# EAGLE design PI0E (EAGLE 7.5.0)
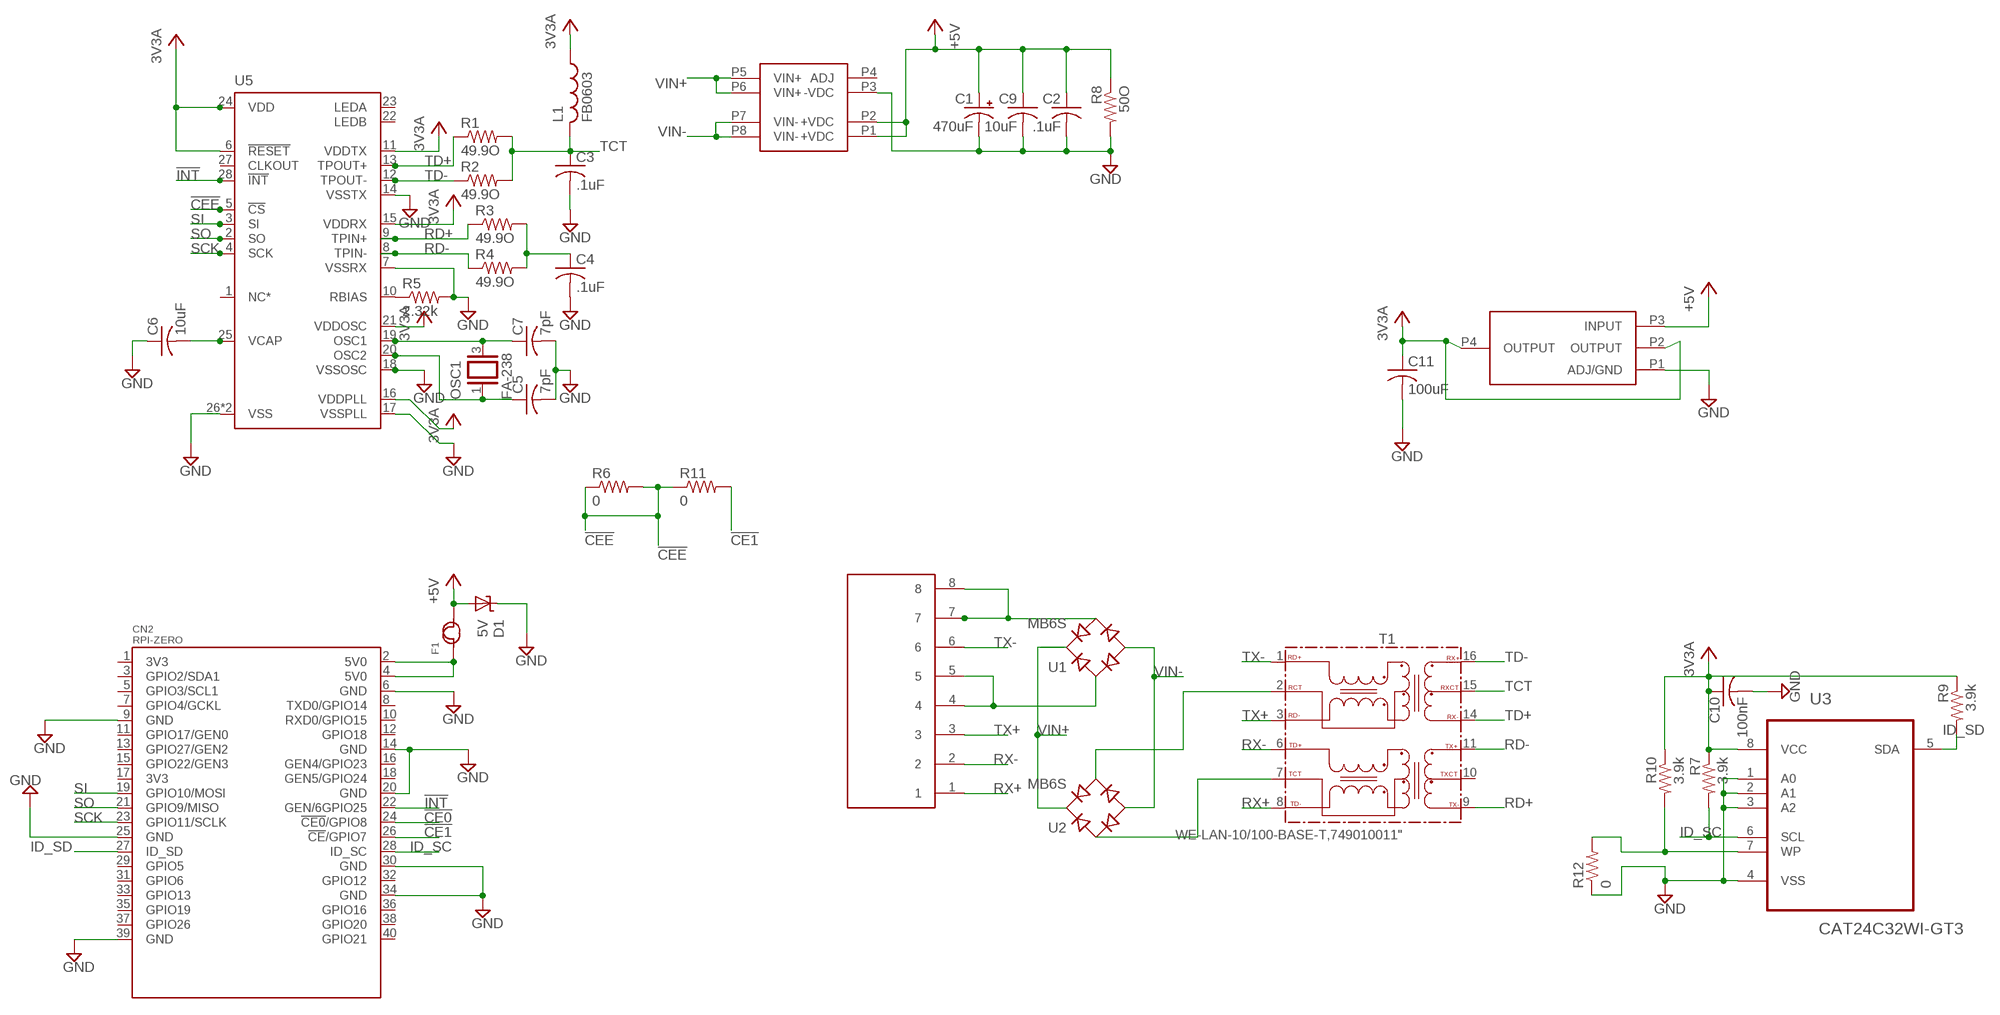
[diagram p0: schematic, sheet 1]

## Parts
C1  470uF  CPOL-USF  [PANASONIC_F]
C2  .1uF  C-USC0603  [C0603]
C3  .1uF  C-USC0603  [C0603]
C4  .1uF  C-USC0603  [C0603]
C5  7pF  C-USC0603  [C0603]
C6  10uF  C-USC0603  [C0603]
C7  7pF  C-USC0603  [C0603]
C9  10uF  C-USC0603  [C0603]
C10  100nF  C-USC0603  [C0603]
C11  100uF  C-USC0805  [C0805]
CN1  RJCSEX38X01XRJCSEX38X01X  [RJCSEX38X01X]
CN2  RPI-ZERO  [RASPBERRYPI_BASTELSTUBE_V13_RASPI_BOARD_B+_FULL]
D1  5V  SUPPRESSOR-SMBJ  [SMBJ]
F1  FUSE'1812'  [F1812]
L1  FB0603  [R0603]
OSC1  FA-238  [FA-238]
R1  49.9O  R-US_R0603  [R0603]
R2  49.9O  R-US_R0603  [R0603]
R3  49.9O  R-US_R0603  [R0603]
R4  49.9O  R-US_R0603  [R0603]
R5  2.32k  R-US_R0603  [R0603]
R6  0  R-US_R0603  [R0603]
R7  3.9k  R-US_R0603  [R0603]
R8  50O  R-US_R0603  [R0603]
R9  3.9k  R-US_R0603  [R0603]
R10  3.9k  R-US_R0603  [R0603]
R11  0  R-US_R0603  [R0603]
R12  0  R-US_R0603  [R0603]
T1  WE-LAN-10/100-BASE-T,749010011"  [749010011]
U1  MB6S  MB4S  [SOIC-4]
U2  MB6S  MB4S  [SOIC-4]
U3  CAT24C32WI-GT3  [SOIC127P600X175-8N]
U4  TLV1117TLV1117DCY  [SOT-223]
U5  ENC28J60QFN28-ML_6X6MM  [QFN28-ML_6X6MM]
U6  AG9800AG9800M  [AG9800M]

## Nets
5V0@1: CN2.2(5V0) CN2.4(5V0) F1.1
!CE0: CN2.24(!CE0!/GPIO8)
!CE1: CN2.26(!CE!/GPIO7) R11.2
!CEE: R6.1 R6.2 R11.1 U5.5(!CS)
!INT: CN2.22(GEN/6GPIO25) U5.28(!INT)
+3V3: C10.1 C11.1 L1.1 R7.1 R9.1 R10.1 U3.8(VCC) U4.P2(OUTPUT) U4.P4(OUTPUT) U5.6(!RESET) U5.11(VDDTX) U5.15(VDDRX) U5.16(VDDPLL) U5.21(VDDOSC) U5.24(VDD) ; supply symbol labelled 3V3A
+5V: C1.+ C2.1 C9.1 D1.A F1.2 R8.1 U4.P3(INPUT) U6.P1(+VDC) U6.P2(+VDC)
GND: C1.- C2.2 C3.2 C4.2 C5.2 C6.1 C7.2 C9.2 C10.2 C11.2 CN2.6(GND) CN2.9(GND) CN2.14(GND) CN2.20(GND) CN2.25(GND) CN2.30(GND) CN2.34(GND) CN2.39(GND) D1.C R5.2 R8.2 R12.1 U3.1(A0) U3.2(A1) U3.3(A2) U3.4(VSS) U4.P1(ADJ/GND) U5.7(VSSRX) U5.14(VSSTX) U5.17(VSSPLL) U5.18(VSSOSC) U5.26(VSS) U5.EXP(VSS) U6.P3(-VDC)
ID_SC: CN2.28(ID_SC) R7.2 U3.6(SCL)
ID_SD: CN2.27(ID_SD) R9.2 U3.5(SDA)
N$1: T1.7(TCT) U2.~1(AC1)
N$4: R10.2 R12.2 U3.7(WP)
N$5: CN1.7 CN1.8 U1.~2(AC2)
N$6: CN1.4 CN1.5 U1.~1(AC1)
N$7: T1.2(RCT) U2.~2(AC2)
N$8: C7.1 OSC1.3 U5.19(OSC1)
N$10: C5.1 OSC1.1 U5.20(OSC2)
N$14: C6.2 U5.25(VCAP)
N$18: C4.1 R3.2 R4.2
N$38: R5.1 U5.10(RBIAS)
RD+: R3.1 T1.9(TX-) U5.9(TPIN+)
RD-: R4.1 T1.11(TX+) U5.8(TPIN-)
RX+: CN1.1 T1.8(TD-)
RX-: CN1.2 T1.6(TD+)
SCK: CN2.23(GPIO11/SCLK) U5.4(SCK)
SI: CN2.19(GPIO10/MOSI) U5.3(SI)
SO: CN2.21(GPIO9/MISO) U5.2(SO)
TCT: C3.1 L1.2 R1.2 R2.2 T1.15(RXCT)
TD+: R1.1 T1.14(RX-) U5.13(TPOUT+)
TD-: R2.1 T1.16(RX+) U5.12(TPOUT-)
TX+: CN1.3 T1.3(RD-)
TX-: CN1.6 T1.1(RD+)
VIN+: U1.+ U2.+ U6.P5(VIN+) U6.P6(VIN+)
VIN-: U1.- U2.- U6.P7(VIN-) U6.P8(VIN-)
Unconnected: CN2.1(3V3) CN2.3(GPIO2/SDA1) CN2.5(GPIO3/SCL1) CN2.7(GPIO4/GCKL) CN2.8(TXD0/GPIO14) CN2.10(RXD0/GPIO15) CN2.11(GPIO17/GEN0) CN2.12(GPIO18) CN2.13(GPIO27/GEN2) CN2.15(GPIO22/GEN3) CN2.16(GEN4/GPIO23) CN2.17(3V3) CN2.18(GEN5/GPIO24) CN2.29(GPIO5) CN2.31(GPIO6) CN2.32(GPIO12) CN2.33(GPIO13) CN2.35(GPIO19) CN2.36(GPIO16) CN2.37(GPIO26) CN2.38(GPIO20) CN2.40(GPIO21) T1.4(NC) T1.5(NC) T1.10(TXCT) T1.12(NC) T1.13(NC) U5.1(NC*) U5.22(LEDB) U5.23(LEDA) U5.27(CLKOUT) U6.P4(ADJ)

## Library data of the parts
C1 = rcl:CPOL-US: POLARIZED CAPACITOR, American symbol
C2-C7 C9-C11 = rcl:C-US: CAPACITOR, American symbol
CN1 = rj45:RJCSEX38X01X
CN2 = RPI-Zero:RPI-ZERO
D1 = diode:SUPPRESSOR-: Suppressor diode
F1 = Seeed-OPL-fuse:FUSE
L1 =  ENC28J60-QFN:FB: Ferrite bead Digikey #P9821BK-ND
OSC1 =  ENC28J60-QFN:FA-238
R1-R5 R7-R10 = rcl:R-US_: RESISTOR, American symbol
R6 R11 R12 = resistor:R-US_: RESISTOR, American symbol
T1 = EagleLibrary_Wuerth_Elektronik_eiSos_rev16a:WE-LAN-10/100-BASE-T,749010011: LAN-Transformer WE-LAN 10/100 Base T - Compliant with IEEE 802.3 standards - SMD -- Ethernet -- Power over Ethernet -- 1 Gigabit Ethernet -- Compliant with most IC's for ethernet applications like Intel, AMD, Globespan and Realtek -- Hub, Router, Switch <http://katalog.we-online.de/media/images/eisos/UtLAN_pf2.jpg> Details see: http://katalog.we-online.de/en/pbs/WE-LAN/S/749010011? Updated by Dan Xu 2014-07-08 2014 (C) Würth Elektronik; COMPANY-URL: http://www.we-online.de; CREATED-BY: Christin Zierenner; CREATED-DATE: June 2012; DATASHEET-URL: http://katalog.we-online.de/kataloge/eisos/media/pdf/749010011.pdf; MANUFACTURER: Würth Elektronik eiSos GmbH
U1 U2 = rectifier:MB*S: Bridge Rectifier Source: http://www.fairchildsemi.com/ds/MB/MB6S.pdf
U3 = Catalyst_Semiconductor_By_element14_Batch_1:CAT24C32WI-GT3: 32-Kb I2C CMOS Serial EEPROM; MPN: CAT24C32WI-GT3; OC_FARNELL: 1718129; OC_NEWARK: 08R5414; PACKAGE: SOIC-8; SUPPLIER: CATALYST SEMICONDUCTOR
U4 = texas_instruments:TLV1117
U5 = microchip:ENC28J60: Stand-Alone Ethernet Controller with SPI Interface Source: http://ww1.microchip.com/downloads/en/DeviceDoc/39662c.pdf
U6 = silvertell:AG9800

## Board
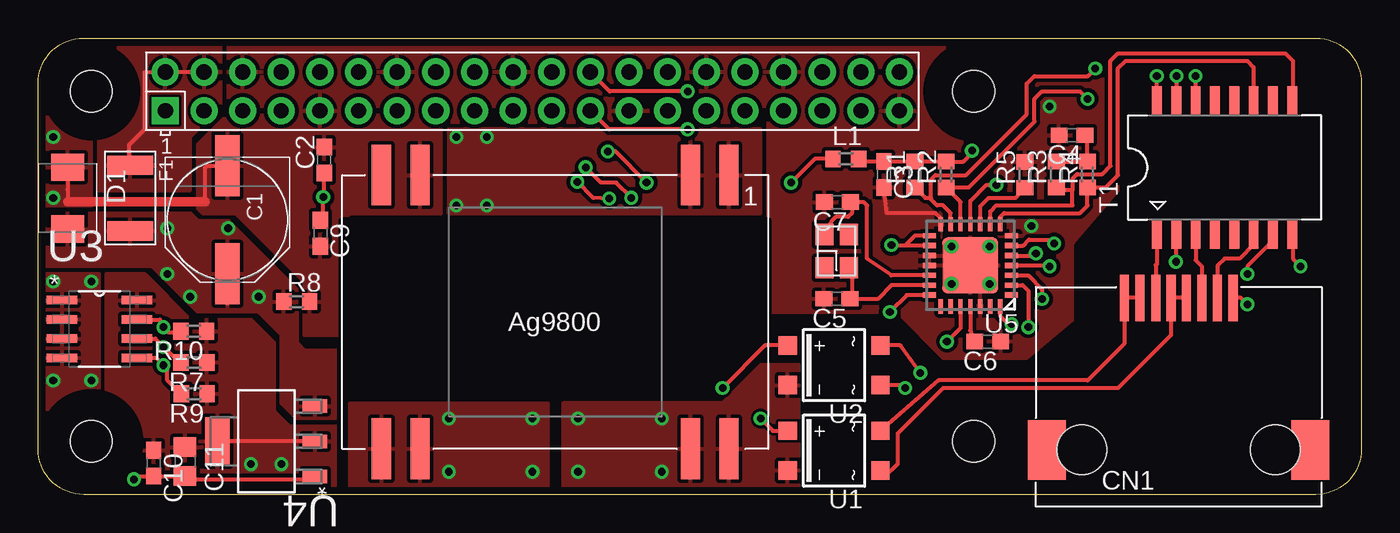
[diagram p1: board, top side]
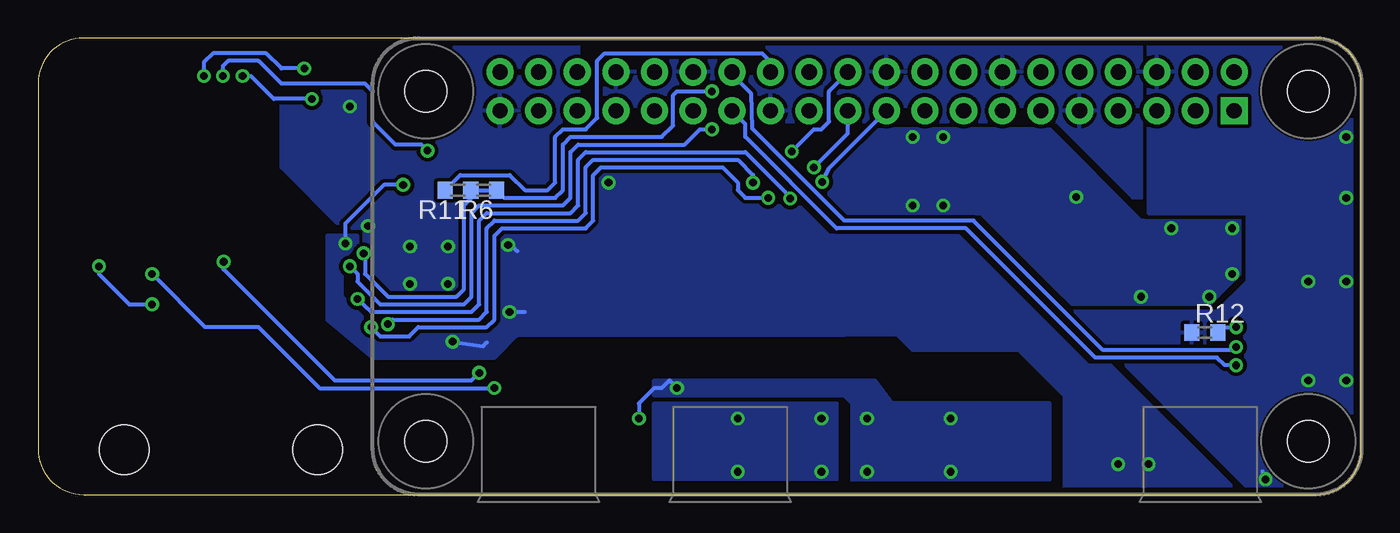
[diagram p2: board, bottom side, seen from below]

Size 87 x 30 mm. Coordinates in mm from the lower left corner, seen from the top.
Outline: 0,3 0,27 arc-90 3,30 84,30 arc-90 87,27 87,3 arc-90 84,0 3,0 arc-90 0,3
Copper layers (1*16): Top 0.035mm / dielectric 1.5mm / Bottom 0.035mm
Design rules "default *": minimum track width 10mil, minimum drill 0.499871875mm, track to track 7mil, track to pad 7mil, pad to pad 7mil, via to via 7mil, smd to smd 7mil, copper to edge 0.5mm, drill to drill 7mil, minimum pad ring 10mil, minimum via ring 8mil, stop-mask expansion 4mil, vias tented up to drill 0mil, thermal gap 10mil
tRestrict: area 0.3,23.3 to 6.7,29.7; area 0.3,0.3 to 6.7,6.7; area 58.3,0.3 to 64.7,6.7; area 58.5,23.5 to 64.5,29.5
bRestrict: area 0.5,23.5 to 6.5,29.5; area 0.5,0.5 to 6.5,6.5; area 58.5,0.5 to 64.5,6.5; area 58.5,23.5 to 64.5,29.5

### Footprints (pad centres in the part's own frame; a part is rotated, then mirrored left to right if it is on the bottom)
PANASONIC_F = smd 4 x 1.6: + 3.55,0; - -3.55,0
C0603 = smd 1.1 x 1: 1 -0.85,0; 2 0.85,0
C0805 = smd 1.3 x 1.5: 1 -0.95,0; 2 0.95,0
RJCSEX38X01X = smd 0.61 x 3.05: 1 3.57,4.99; 2 2.55,4.99; 3 1.53,4.99; 4 0.501,4.99; 5 -0.501,4.99; 6 -1.503,4.99; 7 -2.55,4.99; 8 -3.57,4.99 | smd 2.5 x 3.9: P$4 8.66,-5; P$5 -8.66,-5 | hole 3.25: -6.35,-4.99; 6.35,-4.99
RASPBERRYPI_BASTELSTUBE_V13_RASPI_BOARD_B+_FULL = drill 1 pad 1.778 square: 1 8.37,25.23 | drill 1 pad 1.778: 2 8.37,27.77; 3 10.91,25.23; 4 10.91,27.77; 5 13.45,25.23; 6 13.45,27.77; 7 15.99,25.23; 8 15.99,27.77; 9 18.53,25.23; 10 18.53,27.77; 11 21.07,25.23; 12 21.07,27.77; 13 23.61,25.23; 14 23.61,27.77; 15 26.15,25.23; 16 26.15,27.77; 17 28.69,25.23; 18 28.69,27.77; 19 31.23,25.23; 20 31.23,27.77; 21 33.77,25.23; 22 33.77,27.77; 23 36.31,25.23; 24 36.31,27.77; 25 38.85,25.23; 26 38.85,27.77; 27 41.39,25.23; 28 41.39,27.77; 29 43.93,25.23; 30 43.93,27.77; 31 46.47,25.23; 32 46.47,27.77; 33 49.01,25.23; 34 49.01,27.77; 35 51.55,25.23; 36 51.55,27.77; 37 54.09,25.23; 38 54.09,27.77; 39 56.63,25.23; 40 56.63,27.77 | hole 2.75: 3.5,3.5; 3.5,26.5; 61.5,3.5; 61.5,26.5
SMBJ = smd 1.78 x 2.16: A 2.04,0; C -2.03,0
F1812 = smd 1.27 x 3.048: 1 -2.159,0; 2 2.159,0
R0603 = smd 1 x 1.1: 1 -0.85,0; 2 0.85,0
FA-238 = smd 1.4 x 1.2: 1 -1.1,-0.8; 3 1.1,0.8; GND1 -1.1,0.8; GND2 1.1,-0.8
749010011 = smd 0.64 x 1.91: 1 -4.445,-4.385; 2 -3.175,-4.385; 3 -1.905,-4.385; 4 -0.635,-4.385; 5 0.635,-4.385; 6 1.905,-4.385; 7 3.175,-4.385; 8 4.445,-4.385; 9 4.445,4.385; 10 3.175,4.385; 11 1.905,4.385; 12 0.635,4.385; 13 -0.635,4.385; 14 -1.905,4.385; 15 -3.175,4.385; 16 -4.445,4.385
SOIC-4 = smd 1.2 x 1.2: + 1.3,3.05; - -1.3,3.05; ~1 -1.3,-3.05; ~2 1.3,-3.05
SOIC127P600X175-8N = smd 1.981 x 0.559: 1 -2.464,1.905; 2 -2.464,0.635; 3 -2.464,-0.635; 4 -2.464,-1.905; 5 2.464,-1.905; 6 2.464,-0.635; 7 2.464,0.635; 8 2.464,1.905
SOT-223 = smd 1.626 x 0.889: P1 -3.2,2.311; P2 -3.2,0; P3 -3.2,-2.311 | smd 1.626 x 3.175: P4 3.2,0
QFN28-ML_6X6MM = smd 0.94 x 0.35: 1 -2.7,1.95; 2 -2.7,1.3; 3 -2.7,0.65; 4 -2.7,0; 5 -2.7,-0.65; 6 -2.7,-1.3; 7 -2.7,-1.95; 15 2.7,-1.95; 16 2.7,-1.3; 17 2.7,-0.65; 18 2.7,0; 19 2.7,0.65; 20 2.7,1.3; 21 2.7,1.95 | smd 0.35 x 0.94: 8 -1.95,-2.7; 9 -1.3,-2.7; 10 -0.65,-2.7; 11 0,-2.7; 12 0.65,-2.7; 13 1.3,-2.7; 14 1.95,-2.7; 22 1.95,2.7; 23 1.3,2.7; 24 0.65,2.7; 25 0,2.7; 26 -0.65,2.7; 27 -1.3,2.7; 28 -1.95,2.7 | smd 3.7 x 3.7: EXP 0,0
AG9800M = smd 1.25 x 4: P1 -11.43,-9; P2 -8.89,-9; P3 8.89,-9; P4 11.43,-9; P5 11.43,9; P6 8.89,9; P7 -8.89,9; P8 -11.43,9

### Placement (x,y rotation side)
C1  12.45,18.06 270 top
C2  18.82,21.99 90 top
C3  55.61,21.03 270 top
C4  67.97,23.62 180 top
C5  52.52,12.87 180 top
C6  62.43,10.06 180 top
C7  52.55,19.22 180 top
C9  18.56,17.17 270 top
C10  7.61,2.07 270 top
C11  9.66,2.17 270 top
CN1  74.98,7.93 0 top
CN2  0,0 0 top
D1  1.94,19.49 270 top
F1  6.06,19.48 270 top
L1  53.1,22.06 0 top
OSC1  52.5,16 90 top
R1  57.64,21.03 90 top
R2  59.69,21.03 90 top
R3  66.94,21.03 90 top
R4  68.99,21.03 90 top
R5  64.88,21.01 90 top
R6  57.7,20 180 bottom
R7  10.25,8.68 180 top
R8  17.01,12.68 0 top
R9  10.27,6.62 180 top
R10  10.24,10.73 180 top
R11  59.4,20 180 bottom
R12  10.3,10.65 0 bottom
T1  78,21.5 0 top
U1  52.33,2.89 90 top
U2  52.33,8.5 90 top
U3  4.04,10.88 0 top
U4  15,3.5 180 top
U5  61.29,15.06 180 top
U6  34,12 180 top

### Tracks (layer width: path | path; a pad name or v marks a point on that pad's centre or on a via)
5V0@1
  Top 0.254: F1.1 6.06,21.94 6,22 6,23 7,24 7,27.75 CN2.2 CN2.4
  pour Top: 4,23.5 4,20 10,20 10,23.5 12,25.5 12,29.5 3.5,29.5 3.5,24
!CE0  (via drill 0.5)
  Top 0.254: v42.7,26.5 37.58,26.5 CN2.24
  Bottom 0.254: 56.35,19.5 53,19.5 52.5,20 52.5,23 52,23.5 46,23.5 45.25,24.25 45.25,26.25 45,26.5 v42.7,26.5
!CE1
  Bottom 0.254: CN2.26 38.85,28.45 39.4,29 49.75,29 50.25,28.5 50.25,24.75 51,24 52.5,24 53,23.5 53,20.5 53.5,20 55,20 56,21 59.25,21 R11.2
!CEE  (via drill 0.5)
  Top 0.254: U5.5 65.46,15.71 v65.6,15.85
  Bottom 0.254: v65.6,15.85 65.5,15.75 65.5,14.5 64,13 59.5,13 59,13.5 59,19 58.55,19.45 R11.1 R6.1
!INT  (via drill 0.5)
  Top 0.254: U5.28 63.24,11.76 63.8,11.2 v64,11.2 | v40,20.5 37.95,22.55 v37.45,22.55
  Bottom 0.254: v40,20.5 40,21 41,22 50.5,22 51,21.5 51,18.5 51.5,18 57,18 57.5,17.5 57.5,12 58,11.5 63.7,11.5 v64,11.2 | CN2.22 33.77,27.73 35,26.5 35,24.5 35.5,24 36,24 v37.45,22.55
+3V3  (via drill 0.5)
  Top 0.254: U4.P2 U4.P4 | L1.1 51.06,22.06 v49.5,20.5 | U5.6 64.76,16.36 65.15,16.75 66.75,16.75 v66.8,16.5 | U5.21 57.11,13.11 v56,12 | U5.16 57,16.36 | 57,16.36 56.41,16.36 v56.1,16.4 | U5.15 57.65,17.01 57,16.36 | U5.11 61.29,19.29 62.35,20.35 v63,20.35 | U5.24 60.64,10.94 v59.75,10.05
  Bottom 0.254: v59.75,10.05 57.75,9.75 57.5,10 | v56,12 55,12 | v56.1,16.4 55.85,16.35 55.5,16 | v63,20.35 64.25,20.35 66.8,17.8 v66.8,16.5
  other vias: 14,2 16,2
  pour Top (isolate 0.254, rank 3): 4.5,14.5 7,14.5 10,11.5 14,11.5 15.5,10 15.5,5.5 16.5,4.5 19.5,4.5 19.5,0 4,0 4.5,0.5
  pour Bottom (isolate 0.254): 8.5,0.5 19.5,0.5 19.5,6.5 22.5,9.5 29.5,9.5 30.5,10.5 34,10.5 34,17 26.5,17 18,8.5 16.5,8.5
  pour Bottom (isolate 0.254, rank 2): 34,17 35,17 42,24 51,24 51,10.5 34,10.5
  pour Bottom (isolate 0.254, rank 6): 51,17 56.5,17 57,16.5 57,11.5 58,10.5 58,9 57,9 55.5,10.5 51,10.5
  pour Bottom (isolate 0.254): 57.5,10.5 65,10.5 65,9 57,9 57,10
  pour Bottom (isolate 0.254, rank 6): 64.5,10.5 67,13 67,15.5 66,16.5 66,17 68,17 68,11.5 65,9 64.5,9
+5V  (via drill 0.5)
  Top 0.254: C1.+ 12.45,12.55 | C9.1 18.75,18.21 v18.75,19.55 18.82,19.62 C2.1
  other vias: 27.5,23.5 29.5,23.5 29.5,19 27.5,19 14.5,13 8.5,17.5 8.5,14.5 12.5,17.5 10,13
  pour Top (isolate 0.254, rank 2): 0,18.5 10,18.5 10.5,18 12.5,18 17,13.5 17,10.5 16,10.5 14.5,12 10.5,12 7.5,15 0,15
  pour Top (isolate 0.254): 16,10.5 17,10.5 17,10 17.5,9.5 19.5,9.5 19.5,5 17,5 16,6
  pour Top (isolate 0.254, rank 2): 47.5,18.5 47.5,24 27,24 27,18.5
  pour Bottom (isolate 0.254, rank 2): 39.5,24 34,18.5 25,18.5 19,12.5 10,12.5 8,14.5 8,18 14.5,18 20.5,24
GND  (via drill 0.5)
  Top 0.254: D1.C 1.94,20.06 1.95,19.25 | 11,19.25 11,21.5 11.11,21.61 C1.- | 17.88,0.87 U4.P1 17.5,1 9.83,1 C11.2 C10.2 6.52,1.22 v6.3,1 | U5.14 59.34,18.16 59,18.5 55.79,18.5 C3.2
  Top 0.61: 1.95,19.25 11,19.25
  Bottom 0.254: v6.3,1 6.5,1.5
  other vias: 1,14 3.5,14 3.5,7.5 1,7.5 1,19.5 1,23.5 60.05,16.3 60.05,13.85 62.55,16.3 62.55,13.85 66.5,25.5 65.3,17.65
  pour Top (rank 3): 3.5,23.5 0,25.5 0,19 3.5,19
  pour Top (isolate 0.254, rank 3): 26.5,18.5 26.5,29.5 12.5,29.5 12.5,25 10.5,23 10.5,18.5 13,18.5 17.5,14 17.5,10.5 20,10.5 20,18 20.5,18.5
  pour Top (isolate 0.254): 0,14.5 4,14.5 4,0 0,0
  pour Top (isolate 0.254): 26.5,29.5 26.5,24.5 59,24.5 59,29.5
  pour Bottom (isolate 0.254): 14,18.5 7.5,18.5 7.5,14 9.5,12 19,12 7,0 3,0 0,3 0,26.5 3.5,30 14,30
  pour Bottom (isolate 0.254): 62.5,21 63,21.5 71,21.5 71,30 62.5,30
  pour Top (isolate 0.254): 62.5,30 71,30 71,21.5 62.5,21.5
  pour Bottom (isolate 0.254, rank 2): 56.5,18 57,17.5 57,12 58,11 64.5,11 65.5,12 65.5,17.5 66,18
  pour Bottom (isolate 0.254): 51.5,30 51.5,17.5 67,17.5 71,21.5 71,30
  pour Top (isolate 0.254): 48,30 48,12 56.5,12 59.5,9 65,9 68,11.5 68,16.5 71,20 71,30
  pour Bottom (isolate 0.254): 60.5,18 60.5,17.5 62.5,17.5 62.5,18
  pour Bottom (isolate 0.254, rank 3): 14.5,19.5 15,19.5 20,24.5 23,24.5 51.5,24.5 51.5,30 14.5,30
ID_SC  (via drill 0.5)
  Top 0.254: U3.6 7.71,10.24 v8.25,9.7 9.27,8.68 R7.2
  Bottom 0.254: v8.25,9.7 8.45,9.5 17,9.5 25.5,18 34,18 40.05,24.05 40.1,26.33 41.39,27.62 CN2.28
ID_SD  (via drill 0.5)
  Top 0.254: U3.5 7.78,8.97 v8.25,8.5 8.5,8.25 8.5,7.5 8.83,7.17 R9.2
  Bottom 0.254: v8.25,8.5 9,8.5 9.5,9 17.5,9 26,17.5 34.5,17.5 40.5,23.5 40.5,24.34 CN2.27
N$1  (via drill 0.5)
  Top 0.254: T1.7 81.17,16.68 79.5,15 v79.5,14.5 | v57,7 57.2,7.2 U2.~1
  Bottom 0.254: v79.5,14.5 76,11 72.5,11 68.5,7 v57,7
N$4  (via drill 0.5)
  Top 0.254: U3.7 6.52,11.5 8,11.5 8.25,11.25 v8.25,11 8.57,10.68 9.34,10.68 R10.2
  Bottom 0.254: R12.2 9.1,11 v8.25,11
N$5
  Top 0.254: CN1.7 CN1.8 71.41,9.91 69,7.5 59.19,7.5 U1.~2
N$6
  Top 0.254: CN1.4 CN1.5 74.48,10.48 71,7 59.5,7 56.5,4 56.5,2 55.59,1.09 U1.~1
N$7  (via drill 0.5)
  Top 0.254: T1.2 74.8,17.09 v74.8,15.3 | v58,8 56.7,9.8 U2.~2
  Bottom 0.254: v58,8 58.5,7.5 67.5,7.5 74.8,14.8 v74.8,15.3
N$8
  Top 0.254: U5.19 56.09,14.41 54.5,15.5 54.5,19 54.28,19.22 C7.1 53.5,19.12 53.5,18.5 53.25,18.25 52.45,18.25 52.2,18 OSC1.3
N$10
  Top 0.254: OSC1.1 53.4,14.9 53.5,15 53.5,13 C5.1 53.39,12.85 55.2,12.85 56.11,13.76 U5.20
N$14
  Top 0.254: U5.25 61.29,10.79 61.5,10 61.5,10.23 C6.2
N$18
  Top 0.254: R3.2 R4.2 68.99,23.45 C4.1
N$38
  Top 0.254: U5.10 61.94,18.94 62.5,19.5 64.27,19.5 R5.1
RD+
  Top 0.254: U5.9 62.59,18.59 63,19 68,19 68,20 | T1.9 82.5,25.44 82.5,28.5 82,29 71,29 70.5,28.5 70.5,21.6 69.95,21.05 68.3,21.05 68,20.75 68,20 | 68,20 67.12,20 R3.1
RD-
  Top 0.254: U5.8 63.24,18.24 63.5,18.5 68.5,18.5 68.99,18.99 R4.1 70.18,20.18 71,21 71,28 71.5,28.5 79.5,28.5 79.91,28.09 T1.11
RX+  (via drill 0.5)
  Top 0.254: T1.8 82.5,17.06 82.5,15.5 v83,15 | v79.5,12.5 79.08,12.92 CN1.1
  Bottom 0.254: v83,15 83,14.5 81,12.5 v79.5,12.5
RX-
  Top 0.254: T1.6 79.91,16.41 79,15.5 78,15.5 77.53,15.03 CN1.2
SCK  (via drill 0.5)
  Top 0.254: U5.4 66.44,15.06 v66.5,15 | v42.7,24 37.54,24 CN2.23
  Bottom 0.254: v66.5,15 66,14.5 66,14 64.5,12.5 59,12.5 58.5,13 58.5,18.5 58,19 52.5,19 52,19.5 52,22.5 51.5,23 44.5,23 43.5,24 v42.7,24
SI  (via drill 0.5)
  Top 0.254: U5.3 65.09,14.41 66,13.5 v66,12.85 | v37.55,19.45 36.5,19.5 v35.45,20.55
  Bottom 0.254: v66,12.85 65.1,12 58.5,12 58,12.5 58,18 57.5,18.5 52,18.5 51.5,19 51.5,22 51,22.5 40.5,22.5 37.55,19.55 v37.55,19.45 | v35.45,20.55 35,21.46 CN2.19
SO  (via drill 0.5)
  Top 0.254: U5.2 64.74,13.76 65.1,13.4 v65.1,11 | v39,19.5 38,20.5 37,20.5 v36,21.5
  Bottom 0.254: v39,19.5 40.5,19.5 41,20 41,20.5 42,21.5 50,21.5 50.5,21 50.5,18 51,17.5 56.5,17.5 57,17 57,11.5 57.5,11 62,11 62.6,10.4 64.5,10.4 v65.1,11 | v36,21.5 33.77,23.73 CN2.21
TCT  (via drill 0.5)
  Top 0.254: T1.15 74.85,25.41 v74.85,27.5 | v61.4,22.6 61.4,22.45 60.83,21.88 R2.2 R1.2 C3.1 54.18,21.88 L1.2
  Bottom 0.254: v74.85,27.5 74.85,28.15 74.5,28.5 72.5,28.5 71,27 65.5,27 65,26.5 65,24.5 63.5,23 61.8,23 v61.4,22.6
TD+  (via drill 0.5)
  Top 0.254: T1.14 76.1,25.39 v76.1,27.5 | U5.13 59.99,18.51 59.5,19 59.1,19 58.7,19.4 58.7,19.5 | 58.7,19.5 58.7,20.7 59,21 61,21 65,25 65,27 65.5,27.5 69,27.5 v69.5,28 | R1.1 58.32,19.5 58.7,19.5
  Bottom 0.254: v76.1,27.5 76.1,28.4 75.5,29 72,29 71,28 v69.5,28
TD-  (via drill 0.5)
  Top 0.254: T1.16 73.55,25.39 v73.55,27.5 | U5.12 60.64,19.23 R2.1 61.18,20.18 65.5,24.5 65.5,26 66,26.5 68.5,26.5 v69,26
  Bottom 0.254: v73.55,27.5 73,27.5 71.5,26 v69,26
TX+
  Top 0.254: T1.3 76.1,15.4 76.51,14.99 CN1.3
TX-
  Top 0.254: T1.1 73.55,15.15 73.48,15.08 CN1.6
VIN+  (via drill 0.5)
  Top 0.254: U2.+ 47.8,9.8 v45,7 | v47.5,5 48.31,4.19 U1.+
  Bottom 0.254: v45,7 45.5,7.5 46,7 46.5,7 47.5,6 v47.5,5
  other vias: 27,5 27,1.5 32.5,5 32.5,1.5
  pour Top: 33.5,0.5 20.5,0.5 20.5,6 33.5,6
  pour Bottom: 20.5,6 33.5,6 33.5,1 20.5,1
  pour Bottom: 33,5.5 34,6.5 46.5,6.5 46.5,7.5 32,7.5 30.5,5.5
VIN-  (via drill 0.5)
  other vias: 35.5,5 35.5,1.5 41,5 41,1.5
  pour Top: 50,8.5 47.5,8.5 45,6 34.5,6 34.5,0.5 50,0.5
  pour Bottom: 34.5,6 34.5,1 46.5,1 46.5,6